# EAGLE design zdroj (EAGLE 6.3)
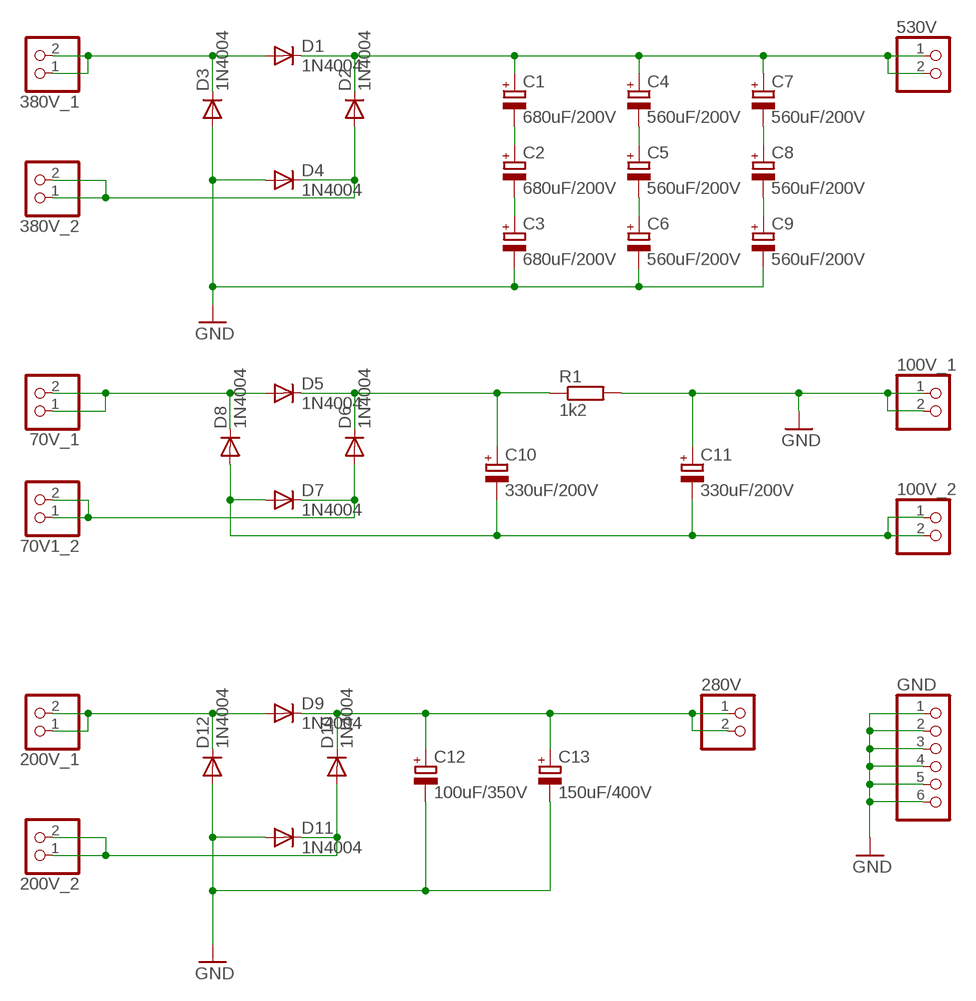
[diagram p0: schematic, sheet 1]

## Parts
70V1_2  PINHD-1X2  [1X02]
70V_1  PINHD-1X2  [1X02]
100V_1  PINHD-1X2  [1X02]
100V_2  PINHD-1X2  [1X02]
200V_1  PINHD-1X2  [1X02]
200V_2  PINHD-1X2  [1X02]
280V  PINHD-1X2  [1X02]
380V_1  PINHD-1X2  [1X02]
380V_2  PINHD-1X2  [1X02]
530V  PINHD-1X2  [1X02]
C1  680uF/200V  CPOL-EUE10-22.5  [EB22,5D]
C2  680uF/200V  CPOL-EUE10-22.5  [EB22,5D]
C3  680uF/200V  CPOL-EUE10-22.5  [EB22,5D]
C4  560uF/200V  CPOL-EUE10-22.5  [EB22,5D]
C5  560uF/200V  CPOL-EUE10-22.5  [EB22,5D]
C6  560uF/200V  CPOL-EUE10-22.5  [EB22,5D]
C7  560uF/200V  CPOL-EUE10-22.5  [EB22,5D]
C8  560uF/200V  CPOL-EUE10-22.5  [EB22,5D]
C9  560uF/200V  CPOL-EUE10-22.5  [EB22,5D]
C10  330uF/200V  CPOL-EUE10-22.5  [EB22,5D]
C11  330uF/200V  CPOL-EUE10-22.5  [EB22,5D]
C12  100uF/350V  CPOL-EUE7.5-18  [E7,5-18]
C13  150uF/400V  CPOL-EUE7.5-18  [E7,5-18]
D1  1N4004  [DO41-10]
D2  1N4004  [DO41-10]
D3  1N4004  [DO41-10]
D4  1N4004  [DO41-10]
D5  1N4004  [DO41-10]
D6  1N4004  [DO41-10]
D7  1N4004  [DO41-10]
D8  1N4004  [DO41-10]
D9  1N4004  [DO41-10]
D10  1N4004  [DO41-10]
D11  1N4004  [DO41-10]
D12  1N4004  [DO41-10]
GND  PINHD-1X6  [1X06]
R1  1k2  R-EU_0309/12  [0309/12]

## Nets
GND: 100V_1.1 100V_1.2 C3.- C6.- C9.- C11.+ C12.- C13.- D3.A D4.A D11.A D12.A GND.1 GND.2 GND.3 GND.4 GND.5 GND.6 R1.2
N$1: 380V_1.1 380V_1.2 D1.A D3.C
N$2: 530V.1 530V.2 C1.+ C4.+ C7.+ D1.C D2.C
N$3: 380V_2.1 380V_2.2 D2.A D4.C
N$4: C7.- C8.+
N$5: 70V_1.1 70V_1.2 D5.A D8.C
N$6: C10.+ D5.C D6.C R1.1
N$7: 70V1_2.1 70V1_2.2 D6.A D7.C
N$8: C8.- C9.+
N$9: 200V_1.1 200V_1.2 D9.A D12.C
N$10: 280V.1 280V.2 C12.+ C13.+ D9.C D10.C
N$11: 200V_2.1 200V_2.2 D10.A D11.C
N$13: C1.- C2.+
N$14: C4.- C5.+
N$15: C2.- C3.+
N$16: C5.- C6.+
N$17: 100V_2.1 100V_2.2 C10.- C11.- D7.A D8.A

## Library data of the parts
70V1_2 70V_1 100V_1 100V_2 200V_1 200V_2 280V 380V_1 380V_2 530V = pinhead:PINHD-1X2: PIN HEADER
C1-C13 = rcl:CPOL-EU: POLARIZED CAPACITOR, European symbol
D1-D12 = diode:1N4004: DIODE general purpose rectifier, 1 A
GND = pinhead:PINHD-1X6: PIN HEADER
R1 = rcl:R-EU_: RESISTOR, European symbol

## Board
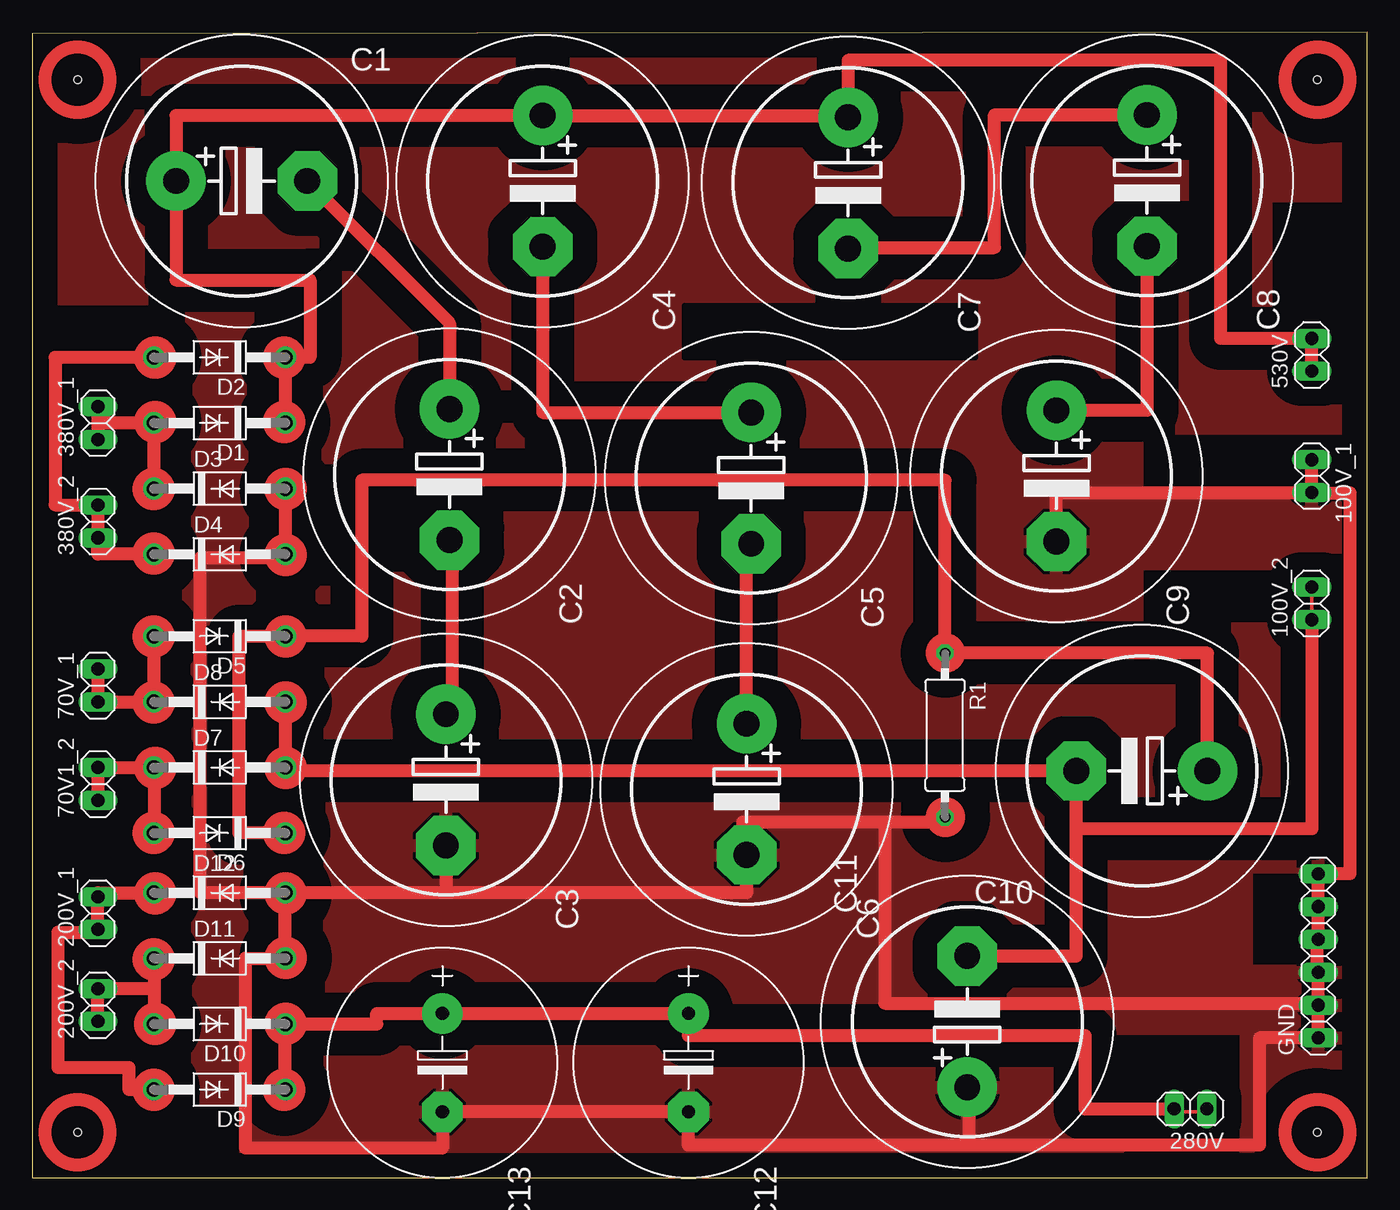
[diagram p1: board, top side]
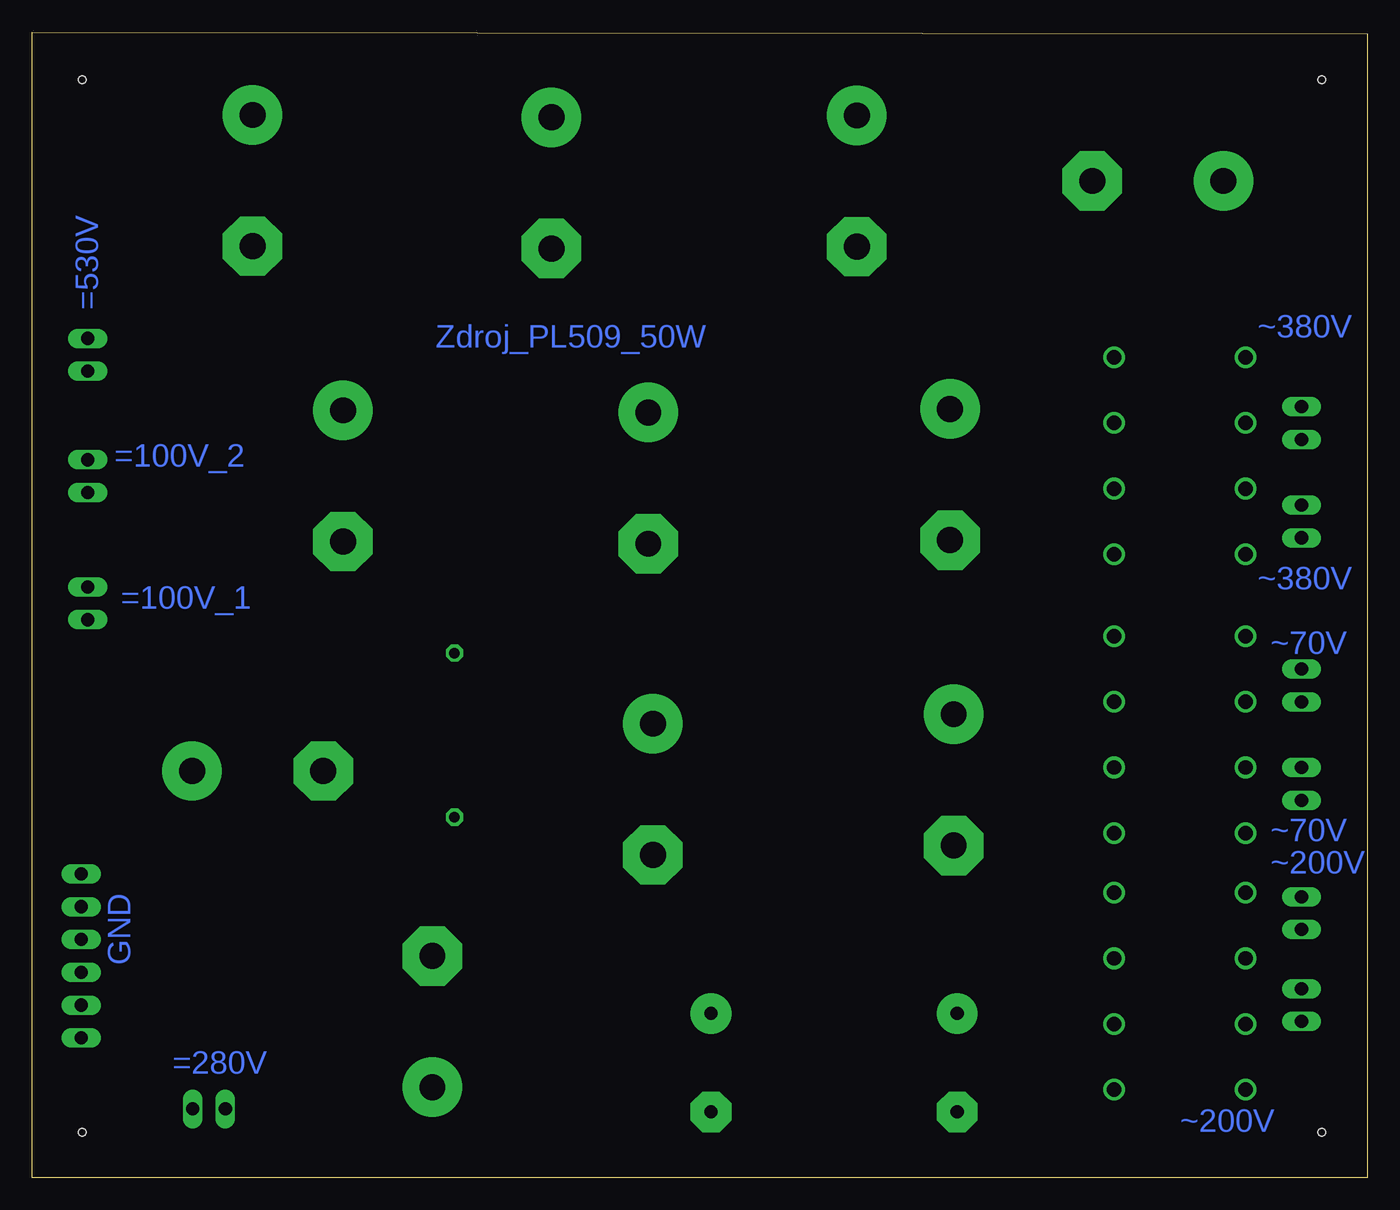
[diagram p2: board, bottom side, seen from below]

Size 103.35 x 88.67 mm. Coordinates in mm from the lower left corner, seen from the top.
Outline: 0,0 103.35,0 103.35,88.67 0,88.57 0,0
Copper layers (1*16): Top 0.035mm / dielectric 1.5mm / Bottom 0.035mm
Design rules "default": minimum track width 10mil, minimum drill 24mil, track to track 8mil, track to pad 8mil, pad to pad 8mil, via to via 8mil, smd to smd 8mil, copper to edge 40mil, drill to drill 8mil, minimum pad ring 10mil, minimum via ring 8mil, stop-mask expansion 4mil, vias tented up to drill 0mil, thermal gap 10mil
Holes 0.6 mm at 99.5,85 3.5,85 99.5,3.5 3.5,3.5

### Footprints (pad centres in the part's own frame; a part is rotated, then mirrored left to right if it is on the bottom)
1X02 = drill 1.016 long: 1 -1.27,0; 2 1.27,0
EB22,5D = drill 2.007 pad 4.597: + -5.08,0 | drill 2.007 pad 4.597 octagon: - 5.08,0
E7,5-18 = drill 1.016 pad 3.15: + -3.81,0 | drill 1.016 pad 3.15 octagon: - 3.81,0
DO41-10 = drill 1.118: A 5.08,0; C -5.08,0
1X06 = drill 1.016 long: 1 -6.35,0; 2 -3.81,0; 3 -1.27,0; 4 1.27,0; 5 3.81,0; 6 6.35,0
0309/12 = drill 0.813 octagon: 1 -6.35,0; 2 6.35,0

### Placement (x,y rotation side)
70V1_2  5.08,30.48 90 top
70V_1  5.08,38.1 90 top
100V_1  99.06,54.3 270 top
100V_2  99.06,44.46 90 top
200V_1  5.08,20.47 90 top
200V_2  5.08,13.35 90 top
280V  89.67,5.31 180 top
380V_1  5.08,58.42 90 top
380V_2  5.08,50.8 90 top
530V  99.06,63.7 90 top
C1  16.21,77.16 0 top
C2  32.3,54.43 270 top
C3  32.02,30.79 270 top
C4  39.52,77.15 270 top
C5  55.66,54.15 270 top
C6  55.3,30.06 270 top
C7  63.16,77.01 270 top
C8  86.3,77.19 270 top
C9  79.3,54.32 270 top
C10  85.9,31.48 180 top
C11  72.38,12.07 90 top
C12  50.8,8.89 270 top
C13  31.75,8.89 270 top
D1  14.51,58.42 180 top
D2  14.51,63.5 180 top
D3  14.51,53.34 0 top
D4  14.51,48.26 0 top
D5  14.51,41.91 180 top
D6  14.51,26.67 180 top
D7  14.51,31.75 0 top
D8  14.51,36.83 0 top
D9  14.51,6.81 180 top
D10  14.51,11.89 180 top
D11  14.51,16.97 0 top
D12  14.51,22.05 0 top
GND  99.56,17.16 90 top
R1  70.66,34.25 270 top

### Tracks (layer width: path | path; a pad name or v marks a point on that pad's centre or on a via)
GND
  Top 1.016: D12.A D11.A 16.51,16.97 16.51,2.27 31.75,2.27 C13.- C12.- 50.8,2.5 72.5,2.5 | D3.A D4.A 19.59,48 13,48 13,22.05 D12.A | C3.- 32.02,22.05 | 32.02,22.05 D12.A | 32.02,22.05 55.3,22.05 C6.- 55,24.98 55,27.5 66,27.5 | 72.5,2.5 95,2.5 95,10.81 GND.1 GND.2 | C11.+ 72.5,6.99 72.5,2.5 | 99.5,13 99.5,13.35 GND.2 | GND.2 GND.3 99.5,15.89 99.5,18 99.56,18 GND.4 GND.5 GND.6 102,23.51 102,53 99.06,53 100V_1.2 | C9.- 79.3,53.03 100V_1.2 | 100V_1.2 100V_1.1 | R1.2 70.66,27.5 66,27.5 | 66,27.5 66,13.5 99.5,13.5
  pour Top (isolate 1.93): 0,88.5 103.5,88.5 103.5,76 96,76 95.5,76 95.5,66 103.5,66 103.5,64.5 103.5,58 85.5,58 85.5,54 85.5,53 103,53 103,47.5 85.5,47.5 85.5,42.5 103.5,42.5 103.5,24 94,24 94,16 103,16 103,0 94,0 94,11.5 84,11.5 84,0 16.5,0 16.5,6 6,6 6,0 0.5,0 0.5,22.5 9,22.5 9,28 9,29 0.5,29 0.5,39 10,39 10,49 0.5,49 0.5,63 10,63 10,68 0,68 0,88
N$1
  Top 1.016: D3.C D1.A 5.08,58.42 | 5.08,58.42 380V_1.1 | 380V_1.2 5.08,58.42
N$2
  Top 1.016: D1.C D2.C 21.5,63.5 21.5,69.5 11.13,69.5 C1.+ 11.13,82.23 C4.+ 63.5,82.23 63.5,82 63.16,82 C7.+ 63.16,86.5 92,86.5 92,64.97 530V.2 530V.1
N$3
  Top 1.016: D4.C 5.08,48.26 380V_2.1 380V_2.2 1.77,52.07 1.77,63.5 D2.A
N$4
  Top 1.016: C7.- 63.16,72 74.5,72 74.5,82.27 C8.+
N$5
  Top 1.016: 70V_1.2 70V_1.1 D8.C D5.A
N$6
  Top 1.016: D6.C 16.01,26.67 16.01,41.91 D5.C 25.5,41.91 25.5,54 70.66,54 R1.1 90.98,40.6 C10.+
N$7
  Top 1.016: 70V1_2.1 70V1_2.2 D7.C D6.A
N$8
  Top 1.016: C8.- 86.3,59.4 C9.+
N$9
  Top 1.016: D12.C 5.08,22.05 200V_1.2 200V_1.1 5.08,19 2,19 2,8.5 7.5,8.5 7.5,6.81 D9.A
N$10
  Top 0.254: 280V.1 91.44,5.08 88.9,5.08 280V.2
  Top 1.016: D9.C D10.C 26.67,11.89 26.67,12.7 C13.+ C12.+ 50.8,11 81.5,11 81.5,5.31 280V.2
N$11
  Top 1.016: 200V_2.1 200V_2.2 9.43,14.62 | D11.C 9.43,14.62 | 9.43,14.62 D10.A
N$13
  Top 1.016: C1.- 32.3,66.15 C2.+
N$14
  Top 1.016: C4.- 39.52,59.23 C5.+
N$15
  Top 1.016: C2.- 32.5,49.35 32.5,36.5 32.02,36.5 C3.+
N$16
  Top 1.016: C6.+ 55.3,49.07 C5.-
N$17
  Top 0.254: 100V_2.1 100V_2.2
  Top 1.016: D8.A D7.A 19.59,31.48 C10.- 80.82,27 | C11.- 80.82,17.15 80.82,27 | 100V_2.1 99.06,27 80.82,27
N$18
  cutout Top: 50.5,67.5 73,67.5 73,63.5 50.5,63.5
(copper drawn outside any net)
  shapes: Top circle x30

### Text on the board
Bottom: =530V | Zdroj_PL509_50W | ~380V | =100V_2 | ~380V | =100V_1 | ~70V | ~70V | ~200V | GND | =280V | ~200V